# EAGLE design Oscillator_RevB (EAGLE 7.6.0)
CNAME: Oscillator (Controller+Synth); CREVISION: Rev B; DESIGNER: Tiago Angelo

## Sheet 1 of 2
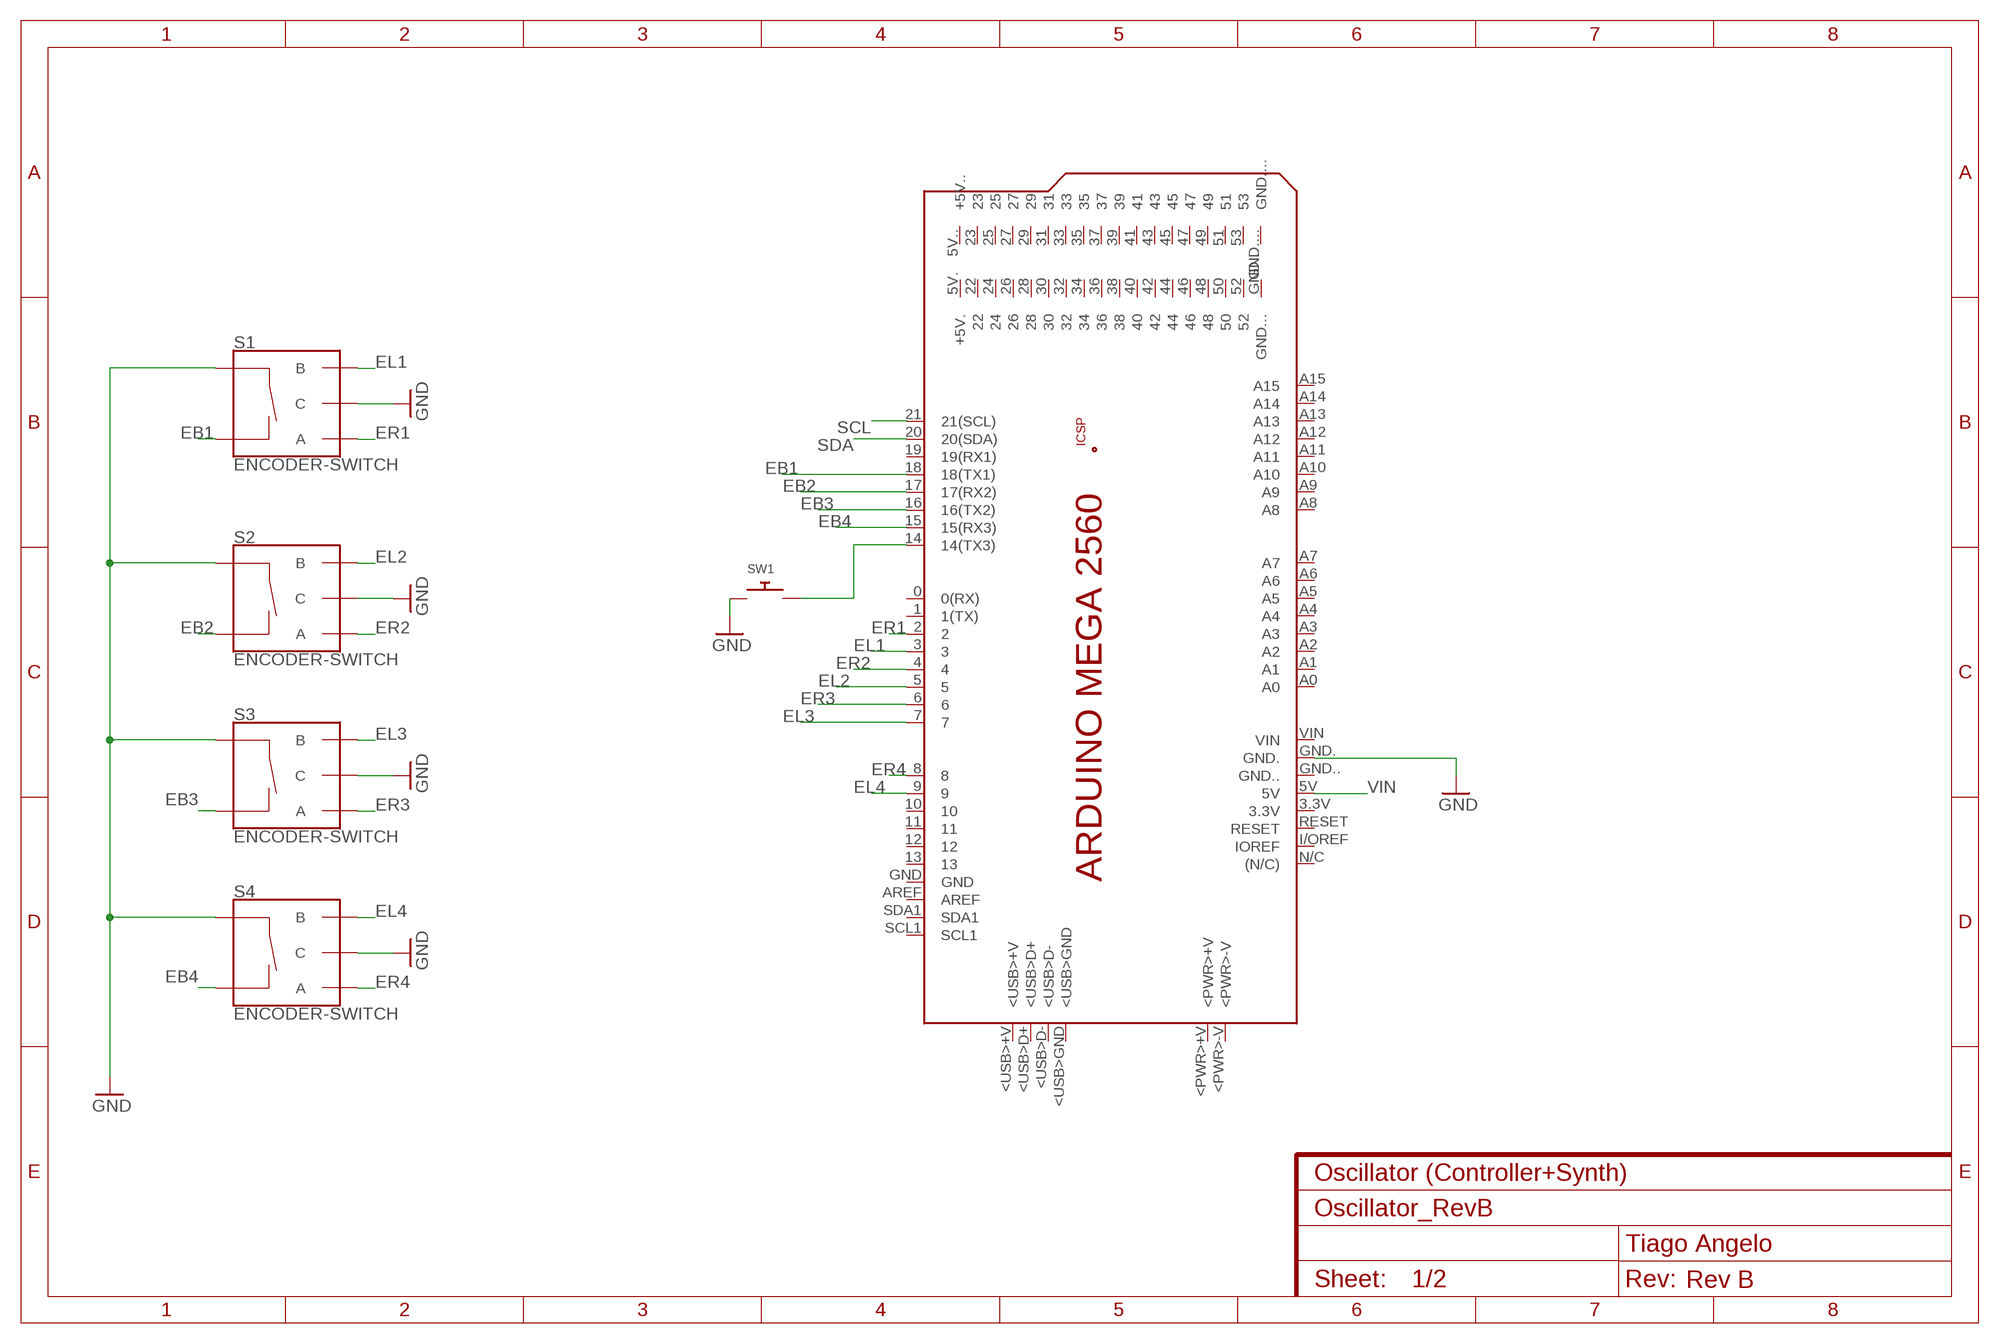
[diagram p0: schematic, sheet 1]

### Parts
PCB1  ARDUINO_MEGA2560  [ARDUINO_MEGA2560]
S1  ENCODER-SWITCH  [ROTARY_ENC_PLAIN]
S2  ENCODER-SWITCH  [ROTARY_ENC_PLAIN]
S3  ENCODER-SWITCH  [ROTARY_ENC_PLAIN]
S4  ENCODER-SWITCH  [ROTARY_ENC_PLAIN]
SW1  SWITCH_PUSHBUTTONEVQ-PE  [TACT_PANA-EVQ]

### Nets
EB1: PCB1.18(18(TX1)) S1.SW-
EB2: PCB1.17(17(RX2)) S2.SW-
EB3: PCB1.16(16(TX2)) S3.SW-
EB4: PCB1.15(15(RX3)) S4.SW-
EL1: PCB1.3 S1.B
EL2: PCB1.5 S2.B
EL3: PCB1.7 S3.B
EL4: PCB1.9 S4.B
ER1: PCB1.2 S1.A
ER2: PCB1.4 S2.A
ER3: PCB1.6 S3.A
ER4: PCB1.8 S4.A
GND: PCB1.GND. S1.C S1.SW+ S2.C S2.SW+ S3.C S3.SW+ S4.C S4.SW+ SW1.P$1 ; also sheet 2
N$7: PCB1.14(14(TX3)) SW1.P$2
SCL: PCB1.21(21(SCL)) ; also sheet 2
SDA: PCB1.20(20(SDA)) ; also sheet 2
VIN: PCB1.5V ; also sheet 2
Unconnected: PCB1.0(0(RX)) PCB1.1(1(TX)) PCB1.3.3V PCB1.5V.(+5V.) PCB1.5V..(+5V..) PCB1.10 PCB1.11 PCB1.12 PCB1.13 PCB1.19(19(RX1)) PCB1.22 PCB1.23 PCB1.24 PCB1.25 PCB1.26 PCB1.27 PCB1.28 PCB1.29 PCB1.30 PCB1.31 PCB1.32 PCB1.33 PCB1.34 PCB1.35 PCB1.36 PCB1.37 PCB1.38 PCB1.39 PCB1.40 PCB1.41 PCB1.42 PCB1.43 PCB1.44 PCB1.45 PCB1.46 PCB1.47 PCB1.48 PCB1.49 PCB1.50 PCB1.51 PCB1.52 PCB1.53 PCB1.+5V_ PCB1.<PWR>+V PCB1.<PWR>-V PCB1.<USB>+V PCB1.<USB>D+ PCB1.<USB>D- PCB1.<USB>GND PCB1.A0 PCB1.A1 PCB1.A2 PCB1.A3 PCB1.A4 PCB1.A5 PCB1.A6 PCB1.A7 PCB1.A8 PCB1.A9 PCB1.A10 PCB1.A11 PCB1.A12 PCB1.A13 PCB1.A14 PCB1.A15 PCB1.AREF PCB1.GND PCB1.GND.. PCB1.GND... PCB1.GND.... PCB1.GND__ PCB1.I/OREF(IOREF) PCB1.MISO PCB1.MOSI PCB1.N/C((N/C)) PCB1.RESET PCB1.RESET. PCB1.SCK PCB1.SCL1 PCB1.SDA1 PCB1.VIN

## Sheet 2 of 2
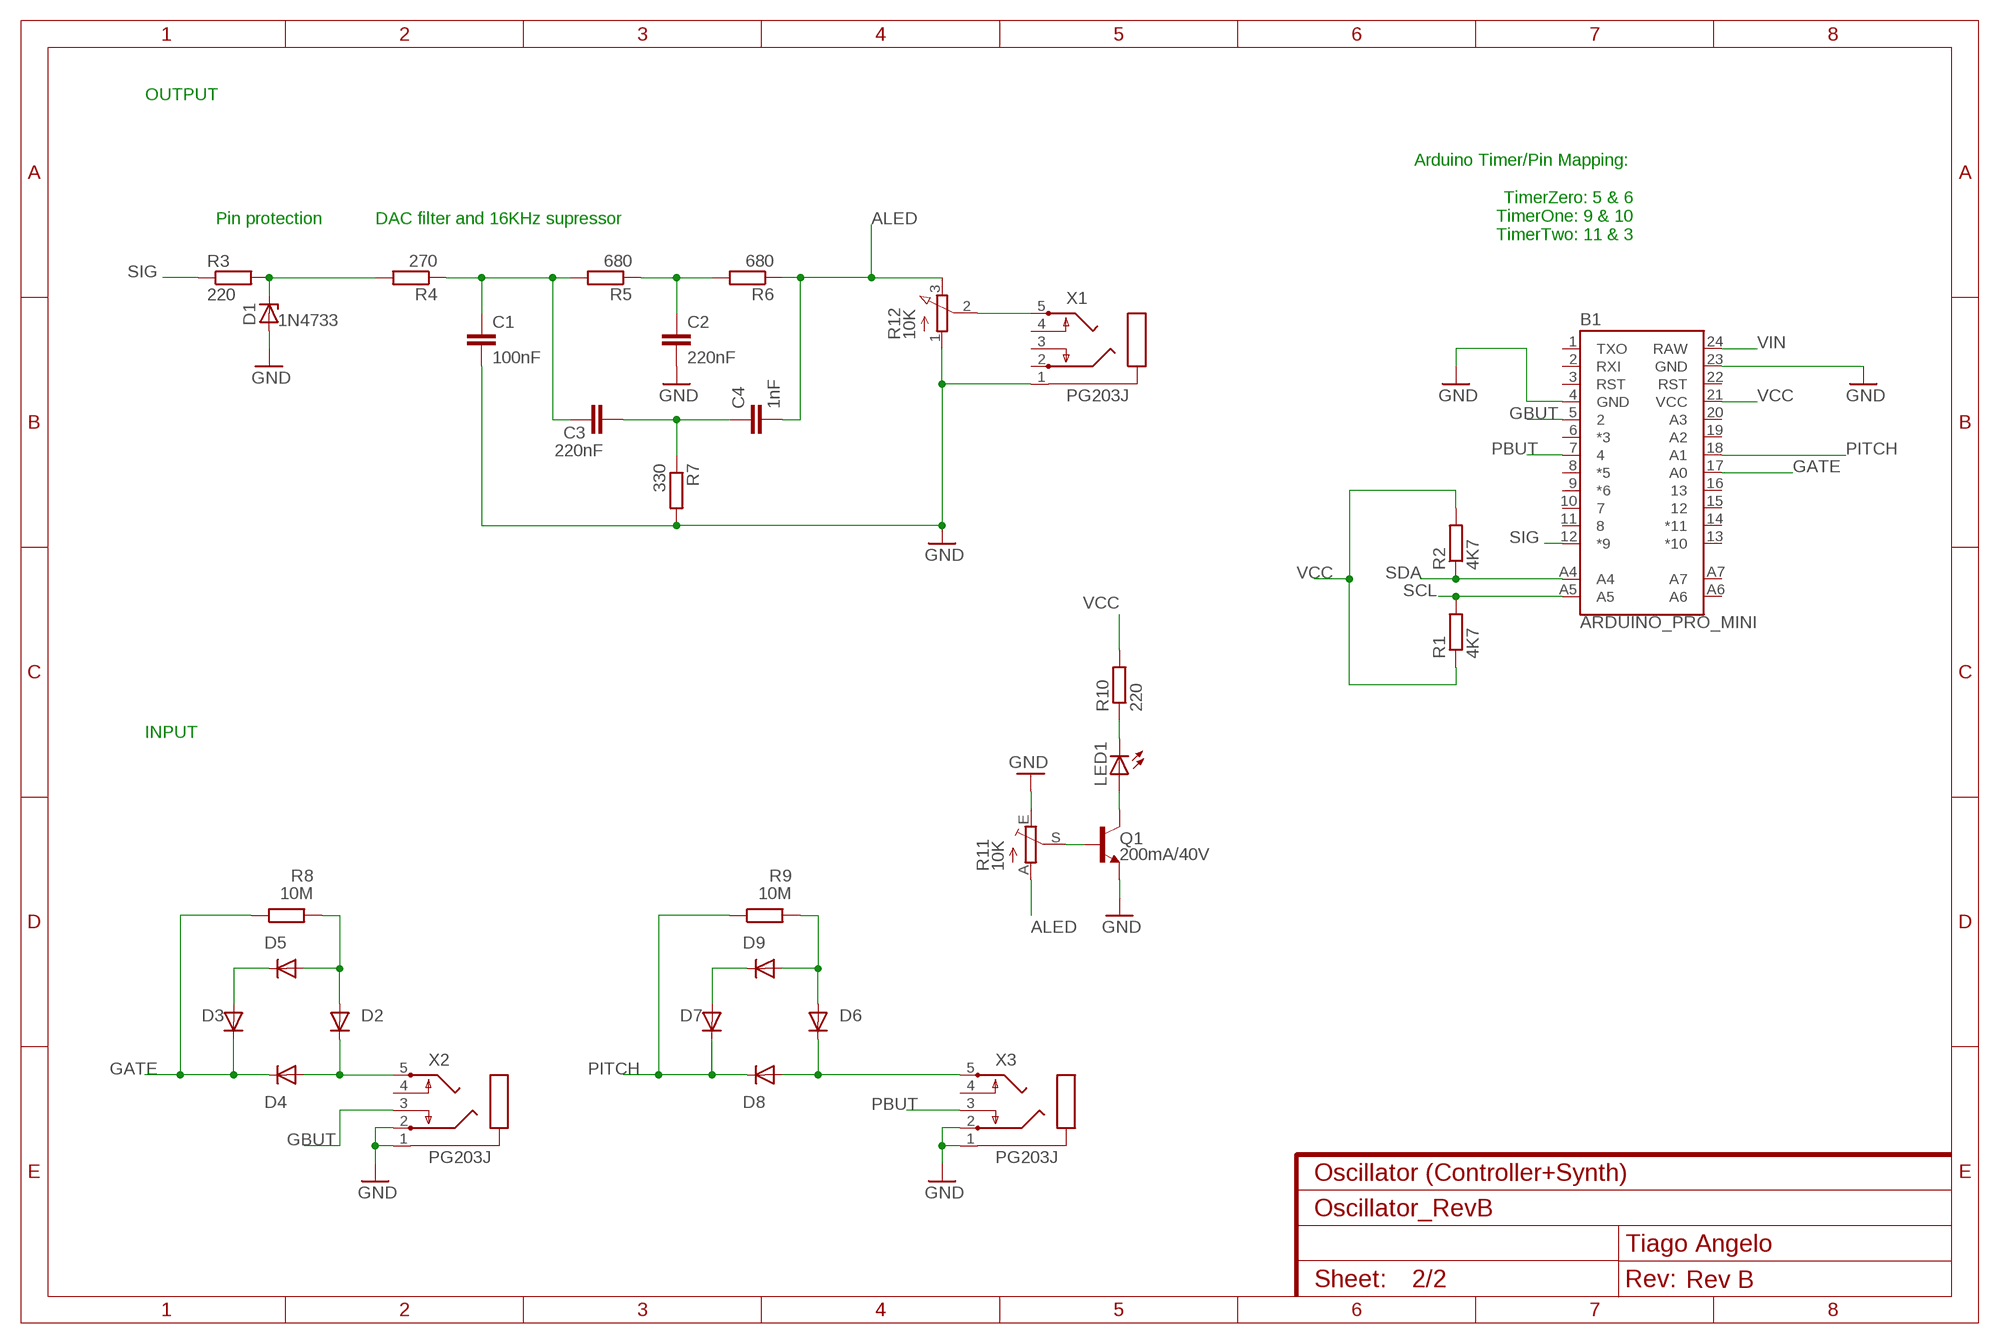
[diagram p1: schematic, sheet 2]

### Parts
B1  ARDUINO_PRO_MINI  [ARDUINO_PRO_MINI]
C1  100nF  C5/3  [C5B3]
C2  220nF  C7.5/6  [C7.5B6]
C3  220nF  C7.5/6  [C7.5B6]
C4  1nF  C5/3  [C5B3]
D1  1N4733  ZENER-DIODEDO34-7  [DO34Z7]
D2  1N4004  [DO41-10]
D3  1N4004  [DO41-10]
D4  1N4004  [DO41-10]
D5  1N4004  [DO41-10]
D6  1N4004  [DO41-10]
D7  1N4004  [DO41-10]
D8  1N4004  [DO41-10]
D9  1N4004  [DO41-10]
LED1  LED5MM  [LED5MM]
Q1  200mA/40V  TRANS_NPN-2N3904  [TO-92]
R1  4K7  R-EU_0204/7  [0204/7]
R2  4K7  R-EU_0204/7  [0204/7]
R3  220  R-EU_0204/7  [0204/7]
R4  270  R-EU_0204/7  [0204/7]
R5  680  R-EU_0204/7  [0204/7]
R6  680  R-EU_0204/7  [0204/7]
R7  330  R-EU_0204/7  [0204/7]
R8  10M  R-EU_0204/7  [0204/7]
R9  10M  R-EU_0204/7  [0204/7]
R10  220  R-EU_0204/7  [0204/7]
R11  10K  TRIM_EU-LI10  [LI10]
R12  10K  3RP/1610N  [3RP/1610N]
X1  PG203J  [PG203J]
X2  PG203J  [PG203J]
X3  PG203J  [PG203J]

### Nets
ALED: C4.2 R6.1 R11.A R12.3(E)
GATE: B1.17(A0) D3.C D4.C R8.1
GBUT: B1.5 X2.3
GND: B1.4(GND) B1.23(GND) C1.2 C2.2 D1.A Q1.1(E) R7.2 R11.E R12.1(A) X1.1 X2.1 X2.2 X3.1 X3.2 ; also sheet 1
N$1: LED1.A Q1.3(C)
N$2: LED1.K(C) R10.1
N$3: D1.C R3.2 R4.2
N$4: C1.1 C3.1 R4.1 R5.2
N$5: C2.1 R5.1 R6.2
N$6: C3.2 C4.1 R7.1
N$8: D2.C D4.A X2.5
N$9: D6.A D9.A R9.2
N$10: D2.A D5.A R8.2
N$11: D3.A D5.C
N$12: D7.A D9.C
N$14: Q1.2(B) R11.S
N$16: R12.2(S) X1.5
PBUT: B1.7 X3.3
PIT_IN: D6.C D8.A X3.5
PITCH: B1.18(A1) D7.C D8.C R9.1
SCL: B1.A5 R1.2 ; also sheet 1
SDA: B1.A4 R2.1 ; also sheet 1
SIG: B1.12(*9) R3.1
VCC: B1.21(VCC) R1.1 R2.2 R10.2
VIN: B1.24(RAW) ; also sheet 1
Unconnected: B1.1(TXO) B1.2(RXI) B1.3(RST) B1.6(*3) B1.8(*5) B1.9(*6) B1.10 B1.11 B1.13(*10) B1.14(*11) B1.15 B1.16 B1.19(A2) B1.20(A3) B1.22(RST) B1.A6 B1.A7 X1.2 X1.3 X1.4 X2.4 X3.4

### Notes on the sheet
- OUTPUT
- Arduino Timer/Pin Mapping: 
  
  TimerZero: 5 & 6
  TimerOne: 9 & 10
  TimerTwo: 11 & 3
- Pin protection | DAC filter and 16KHz supressor
- INPUT

## Library data of the parts
B1 = SparkFun-Boards:ARDUINO_PRO_MINI: SparkFun Pro Mini Pro Mini compatible footprint. Dimensions: 0.7 x 1.3" PCB Thickness: 0.8mm SparkFun Products: 3.3V/8MHz <https://www.sparkfun.com/products/11114> 5V/16MHz <https://www.sparkfun.com/products/11113>
C1-C4 = capacitor-wima:C: CAPACITOR naming: grid - package width
D1 = diode:ZENER-DIODE: Z-Diode
D2-D9 = adafruit:1N4004: DIODE General purpose 1N400x type rectifier (With bigger pads) http://www.ladyada.net/library/pcb/eaglelibrary.html
LED1 = adafruit:LED: LED OSRAM: - CHIPLED LG R971, LG N971, LY N971, LG Q971, LY Q971, LO R971, LY R971 LH N974, LH R974 LS Q976, LO Q976, LY Q976 LO Q996 - Hyper CHIPLED LW Q18S LB Q993, LB Q99A, LB R99A - SideLED LS A670, LO A670, LY A670, LG A670, LP A670 LB A673, LV A673, LT A673, LW A673 LH A674 LY A675 LS A676, LA A676, LO A676, LY A676, LW A676 LS A679, LY A679, LG A679 - Hyper Micro SIDELED® LS Y876, LA Y876, LO Y876, LY Y876 LT Y87S - SmartLED LW L88C, LW L88S LB L89C, LB L89S, LG L890 LS L89K, LO L89K, LY L89K LS L896, LA L896, LO L896, LY L896 - TOPLED LS T670, LO T670, LY T670, LG T670, LP T670 LSG T670, LSP T670, LSY T670, LOP T670, LYG T670 LG T671, LOG T671, LSG T671 LB T673, LV T673, LT T673, LW T673 LH T674 LS T676, LA T676, LO T676, LY T676, LB T676, LH T676, LSB T676, LW T676 LB T67C, LV T67C, LT T67C, LS T67K, LO T67K, LY T67K, LW E67C LS E67B, LA E67B, LO E67B, LY E67B, LB E67C, LV E67C, LT E67C LW T67C LS T679, LY T679, LG T679 LS T770, LO T770, LY T770, LG T770, LP T770 LB T773, LV T773, LT T773, LW T773 LH T774 LS E675, LA E675, LY E675, LS T675 LS T776, LA T776, LO T776, LY T776, LB T776 LHGB T686 LT T68C, LB T68C - Hyper Mini TOPLED® LB M676 - Mini TOPLED Santana® LG M470 LS M47K, LO M47K, LY M47K Source: http://www.osram.convergy.de/
PCB1 = E14_Arduino_revC:ARDUINO_MEGA2560: Device for representing an Arduino Mega 2560 board with a footprint in an EAGLE design. Created by Dave Young for Element14. More EAGLE documentation at: http://www.element14.com/community/community/knode/cadsoft_eagle
Q1 = SparkFun-DiscreteSemi:TRANS_NPN: NPN transistor Current controlled devices typically used to amplify current or used as a switch. BC547 - COM-08928 <http://www.sparkfun.com/products/8928> (TO-92 45V 100mA) (1.Collector 2.Base 3.Emitter) 2N3904 - COM-00521 <http://www.sparkfun.com/products/521> (TO-92 40V 200mA) (1.Emitter 2.Base 3.Collector) P2N2222A - COM-12852 <http://www.sparkfun.com/products/12852> (TO-92 40V 600mA) (1.Collector 2.Base 3.Emitter); PROD_ID: TRANS-08447
R1-R10 = resistor:R-EU_: RESISTOR, European symbol
R11 = pot:TRIM_EU-: POTENTIOMETER
R12 = pot:3RP/1610N: 16mm Potentiometer one level Source: http://www.alphapotentiometers.net/html/16mm_pot_2.html
S1-S4 = SparkFun-Switches:ENCODER-SWITCH: Rotary Encoder w/ Select Switch Encoders rotate similarly to potentiometers, but they’re different from potentiometers in that an encoder has full rotation without limits. They output gray code so that you can tell how much and in which direction the encoder has been turned. This encoder includes a push-down select switch built into the shaft. SparkFun Products Rotary Encoder <https://www.sparkfun.com/products/9117> (COM-09117); SF_SKU: COM-09117
SW1 = adafruit:SWITCH_PUSHBUTTON: Buttons SOFTTOUCHSMD_SJ - Soft touch temporary push button (Super Junk Akihabara) Compatible with SKPMANE010 [Mouser: 688-SKPMAN] C&K_KSS = Digikey: KSS221GLFS
X1-X3 = con-hirschmann:PG203J: MIC/HEADPHONE JACK KS-S stereo microphone/headphone jack PG203JN (Schukat); OC_FARNELL: unknown; OC_NEWARK: unknown

## Board
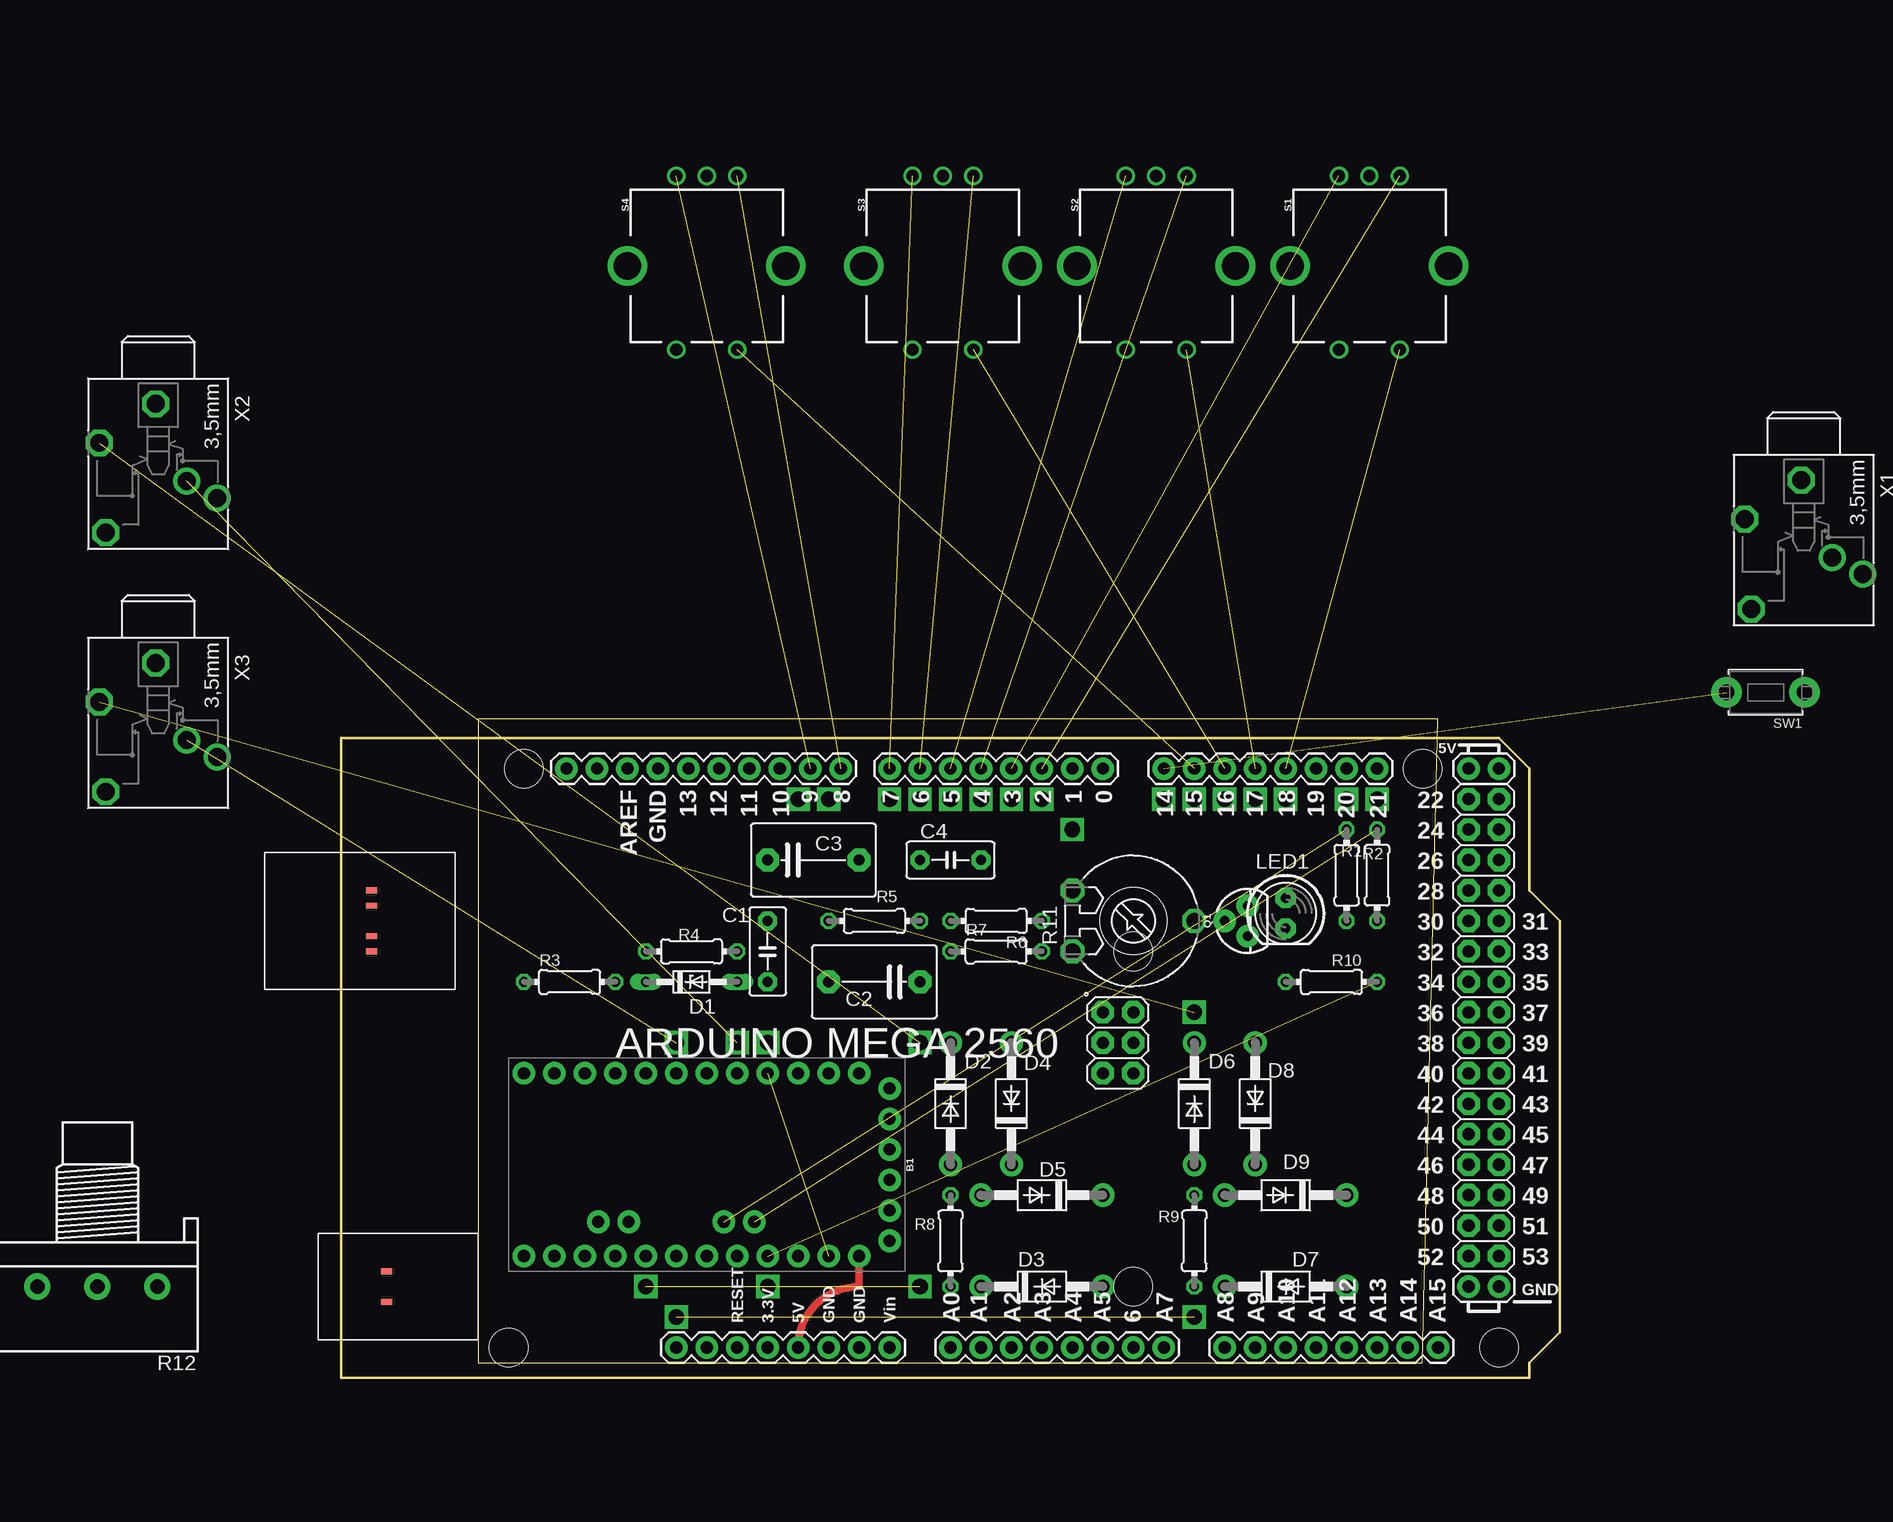
[diagram p2: board, top side]
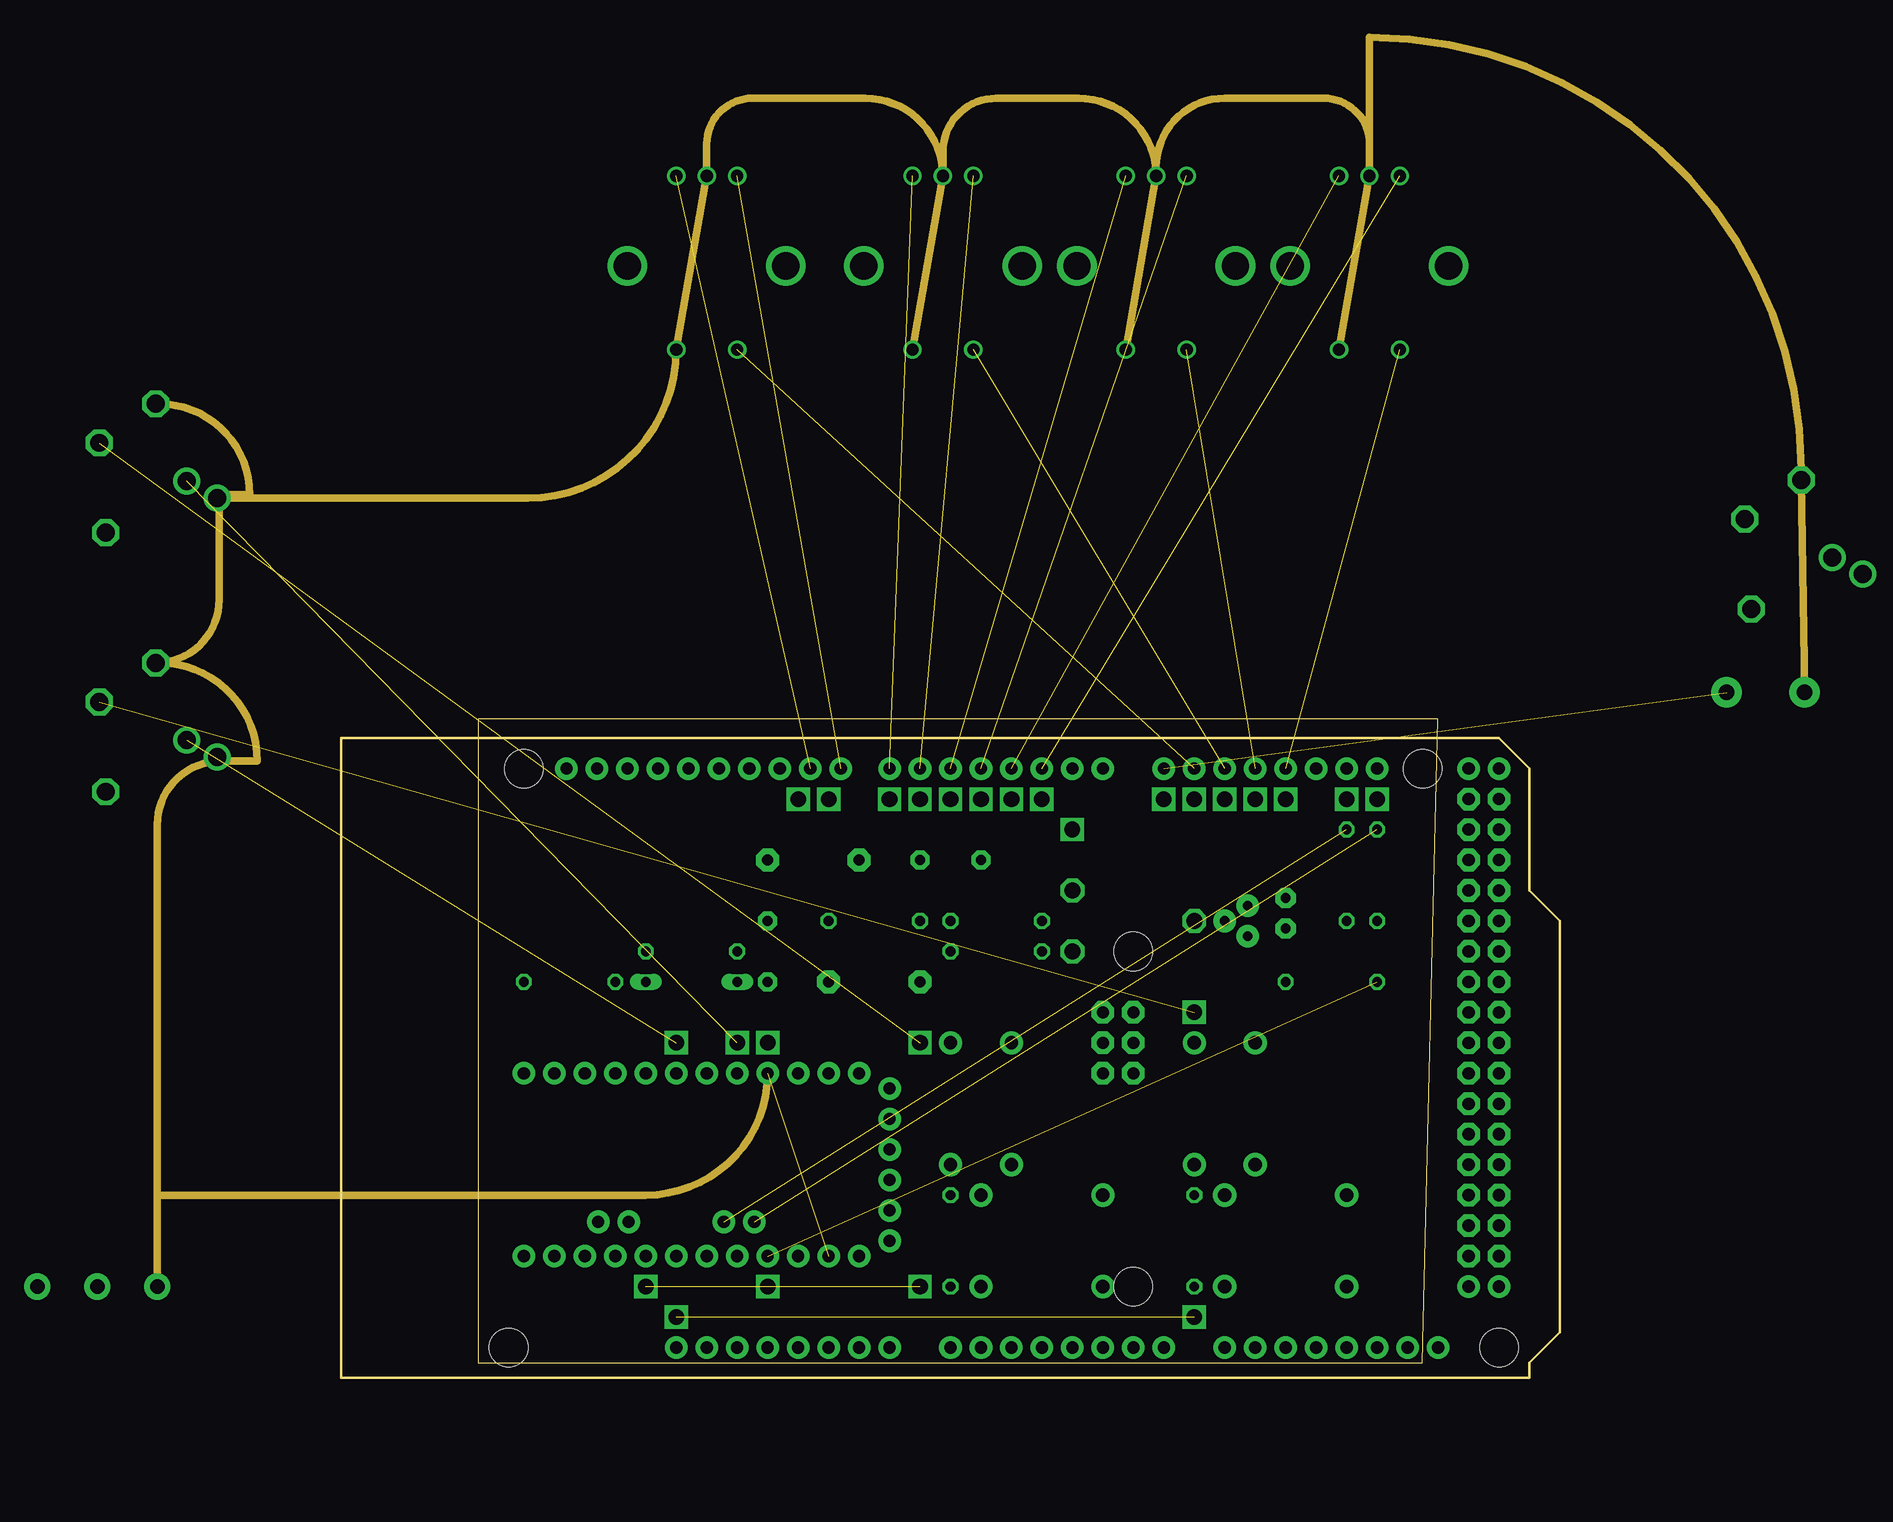
[diagram p3: board, inner layer Route2]
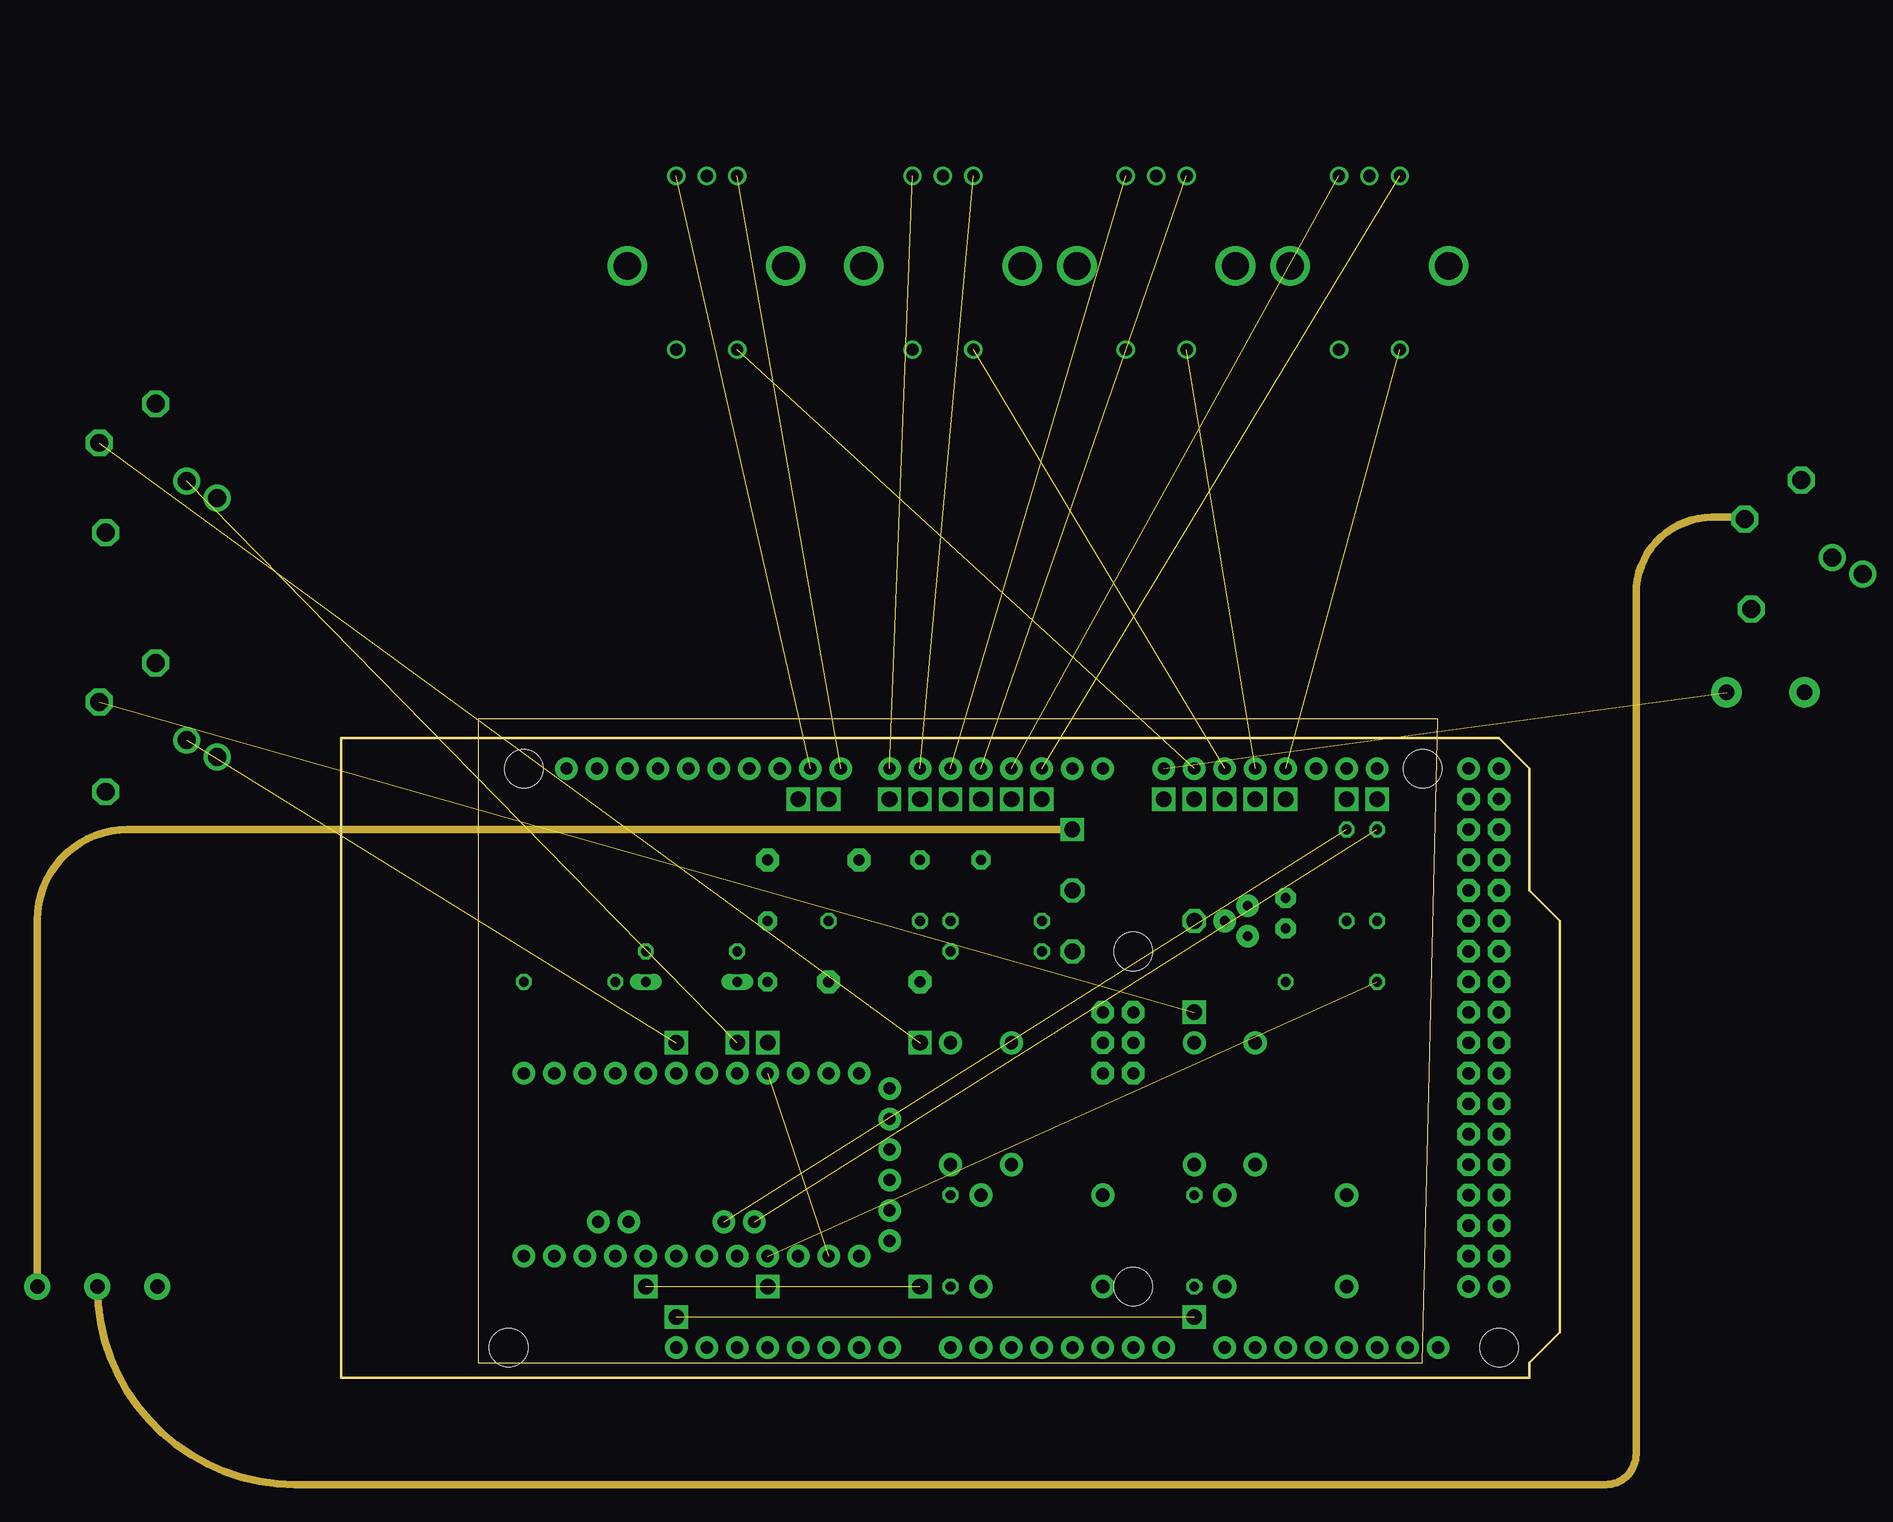
[diagram p4: board, inner layer Route15]
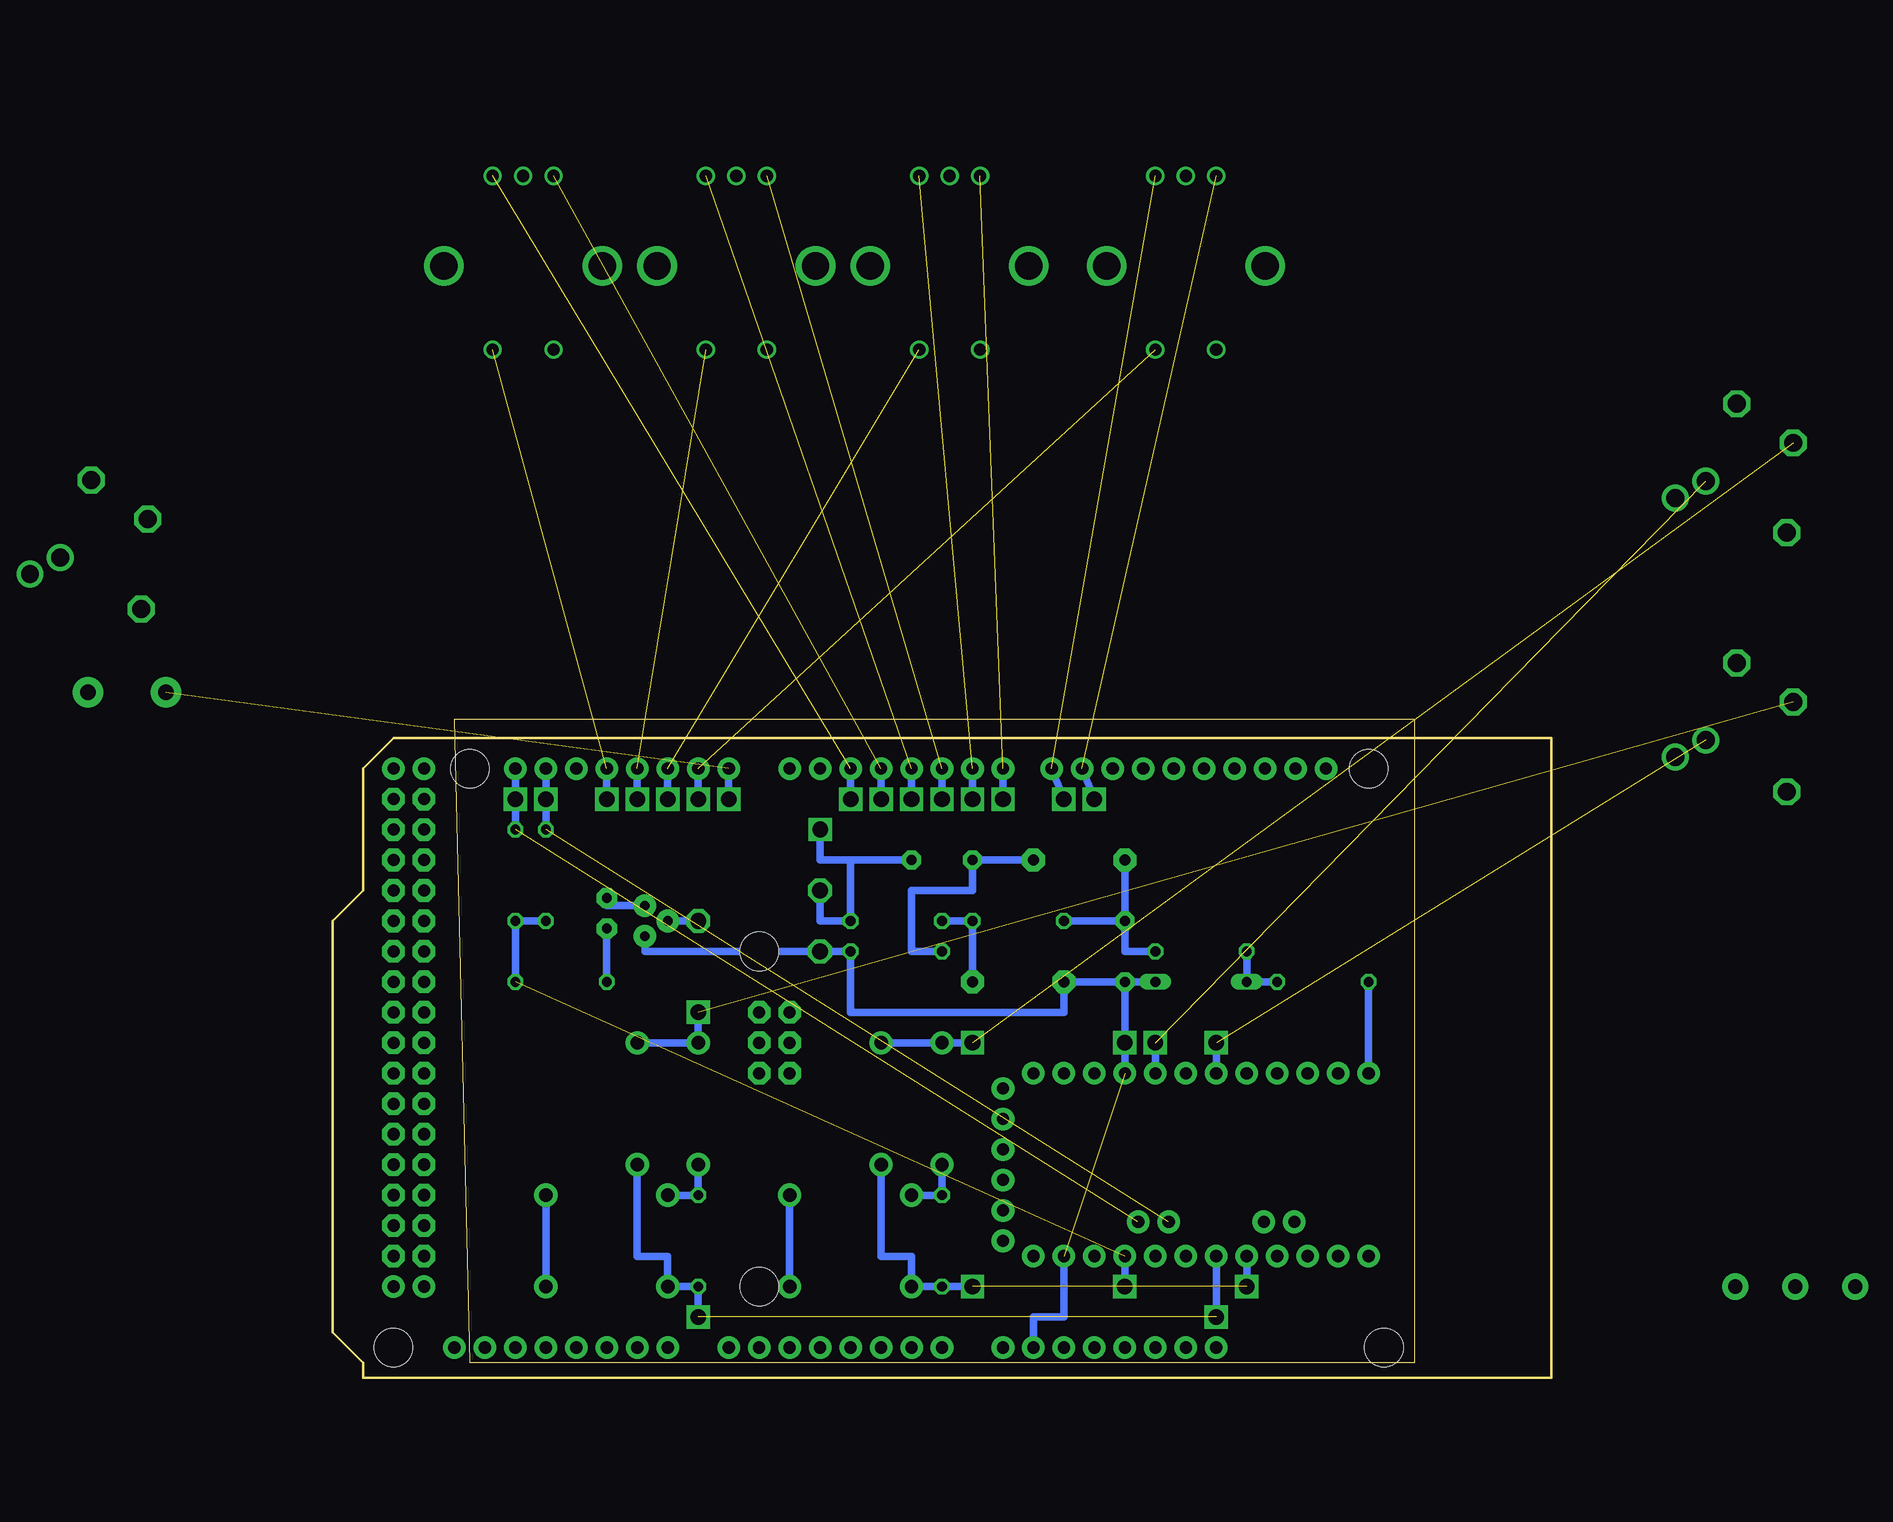
[diagram p5: board, bottom side, seen from below]

Size 101.6 x 54.92 mm. Coordinates in mm from the lower left corner, seen from the top.
Outline: 11.43,1.27 90.15,1.27 91.42,54.92 11.43,54.92 11.43,1.27
Copper layers ((1*2)+(15*16)): Top 0.035mm / dielectric 1.5mm / Route2 0.035mm / dielectric 0.15mm / Route15 0.035mm / dielectric 0.2mm / Bottom 0.035mm
Design rules "default *": minimum track width 10mil, minimum drill 24mil, track to track 8mil, track to pad 8mil, pad to pad 8mil, via to via 8mil, smd to smd 8mil, copper to edge 40mil, drill to drill 8mil, minimum pad ring 10mil, minimum via ring 8mil, stop-mask expansion 4mil, vias tented up to drill 0mil, thermal gap 10mil
vRestrict: area 62.2,24.1 to 67.3,31.8; area 92.7,6.3 to 97.8,52.1

### Footprints (pad centres in the part's own frame; a part is rotated, then mirrored left to right if it is on the bottom)
ARDUINO_PRO_MINI = drill 1.016 pad 1.88: 1 -7.62,12.7; 2 -7.62,10.16; 3 -7.62,7.62; 4 -7.62,5.08; 5 -7.62,2.54; 6 -7.62,0; 7 -7.62,-2.54; 8 -7.62,-5.08; 9 -7.62,-7.62; 10 -7.62,-10.16; 11 -7.62,-12.7; 12 -7.62,-15.24; 13 7.62,-15.24; 14 7.62,-12.7; 15 7.62,-10.16; 16 7.62,-7.62; 17 7.62,-5.08; 18 7.62,-2.54; 19 7.62,0; 20 7.62,2.54; 21 7.62,5.08; 22 7.62,7.62; 23 7.62,10.16; 24 7.62,12.7; A4 4.763,1.429; A5 4.763,3.969; A6 4.763,-9.049; A7 4.763,-6.509; BLK -6.35,15.24; GND -3.81,15.24; GRN 6.35,15.24; RXI 1.27,15.24; TXO 3.81,15.24; VCC -1.27,15.24
C5B3 = drill 0.813 pad 1.6 octagon: 1 -2.54,0; 2 2.54,0
C7.5B6 = drill 0.914 pad 1.905 octagon: 1 -3.81,0; 2 3.81,0
DO34Z7 = drill 0.813 long: A 3.81,0; C -3.81,0
DO41-10 = drill 1.118 pad 1.93: A 5.08,0; C -5.08,0
LED5MM = drill 0.813 pad 1.676 octagon: A -1.27,0; K 1.27,0
ARDUINO_MEGA2560 = drill 1.016 pad 1.88: 0 63.5,50.8; 1 60.96,50.8; 2 58.42,50.8; 3 55.88,50.8; 3.3V 35.56,2.54; 4 53.34,50.8; 5 50.8,50.8; 5V 38.1,2.54; 5V. 93.98,50.8; 5V.. 96.52,50.8; 6 48.26,50.8; 7 45.72,50.8; 8 41.656,50.8; 9 39.116,50.8; 10 36.576,50.8; 11 34.036,50.8; 12 31.496,50.8; 13 28.956,50.8; 14 68.58,50.8; 15 71.12,50.8; 16 73.66,50.8; 17 76.2,50.8; 18 78.74,50.8; 19 81.28,50.8; 20 83.82,50.8; 21 86.36,50.8; A0 50.8,2.54; A1 53.34,2.54; A2 55.88,2.54; A3 58.42,2.54; A4 60.96,2.54; A5 63.5,2.54; A6 66.04,2.54; A7 68.58,2.54; A8 73.66,2.54; A9 76.2,2.54; A10 78.74,2.54; A11 81.28,2.54; A12 83.82,2.54; A13 86.36,2.54; A14 88.9,2.54; A15 91.44,2.54; AREF 23.876,50.8; GND 26.416,50.8; GND. 43.18,2.54; GND.. 40.64,2.54; GND... 93.98,7.62; GND.... 96.52,7.62; I/OREF 30.48,2.54; N/C 27.94,2.54; RESET 33.02,2.54; SCL1 18.796,50.8; SDA1 21.336,50.8; VIN 45.72,2.54 | drill 1.016 pad 1.88 octagon: 22 93.98,48.26; 23 96.52,48.26; 24 93.98,45.72; 25 96.52,45.72; 26 93.98,43.18; 27 96.52,43.18; 28 93.98,40.64; 29 96.52,40.64; 30 93.98,38.1; 31 96.52,38.1; 32 93.98,35.56; 33 96.52,35.56; 34 93.98,33.02; 35 96.52,33.02; 36 93.98,30.48; 37 96.52,30.48; 38 93.98,27.94; 39 96.52,27.94; 40 93.98,25.4; 41 96.52,25.4; 42 93.98,22.86; 43 96.52,22.86; 44 93.98,20.32; 45 96.52,20.32; 46 93.98,17.78; 47 96.52,17.78; 48 93.98,15.24; 49 96.52,15.24; 50 93.98,12.7; 51 96.52,12.7; 52 93.98,10.16; 53 96.52,10.16; +5V_ 66.04,30.48; GND__ 66.04,25.4; MISO 63.5,30.48; MOSI 66.04,27.94; RESET. 63.5,25.4; SCK 63.5,27.94 | smd 1.016 x 0.508: <PWR>+V 3.81,8.89; <PWR>-V 3.81,6.35; <USB>+V 2.54,40.64; <USB>D+ 2.54,39.37; <USB>D- 2.54,36.83; <USB>GND 2.54,35.56 | hole 3.2: 15.24,50.8; 13.97,2.54; 66.04,35.56; 66.04,7.62; 90.17,50.8; 96.52,2.54
TO-92 = drill 0.813 pad 1.88: 1 -1.27,0; 2 0,1.905; 3 1.27,0
0204/7 = drill 0.813 octagon: 1 -3.81,0; 2 3.81,0
LI10 = drill 1.321 octagon: A -2.54,-5.08; E 2.54,-5.08; S 0,5.08
3RP/1610N = drill 1.2 pad 2.184: 1 -5,0; 2 0,0; 3 5,0
ROTARY_ENC_PLAIN = drill 1.016: A 7.493,-2.54; B 7.493,2.54; C 7.493,0; SW+ -6.985,2.54; SW- -6.985,-2.54 | drill 2.286: P$3 0,6.604; P$4 0,-6.604
TACT_PANA-EVQ = drill 1.3 pad 2.54: P$1 -3.25,0; P$2 3.25,0
PG203J = drill 1.499 octagon: 1 -5.004,-0.203; 4 5.74,-4.369; 5 -1.753,-4.902 | drill 1.499: 2 2.845,4.902; 3 1.448,2.388

### Placement (x,y rotation side)
B1  30.48,17.78 270 top
C1  35.56,35.56 270 top
C2  44.45,33.02 180 top
C3  39.37,43.18 0 top
C4  50.8,43.18 0 top
D1  29.21,33.02 0 top
D2  50.8,22.86 270 top
D3  58.42,7.62 0 top
D4  55.88,22.86 90 top
D5  58.42,15.24 180 top
D6  71.12,22.86 270 top
D7  78.74,7.62 0 top
D8  76.2,22.86 90 top
D9  78.74,15.24 180 top
LED1  78.74,38.74 270 top
PCB1  0,0 0 top
Q1  75.56,38.1 90 top
R1  86.36,41.91 90 top
R2  83.82,41.91 270 top
R3  19.05,33.02 0 top
R4  29.21,35.56 180 top
R5  44.45,38.1 180 top
R6  54.61,38.1 180 top
R7  54.61,35.56 0 top
R8  50.8,11.43 90 top
R9  71.12,11.43 90 top
R10  82.55,33.02 0 top
R11  66.04,38.1 270 top
R12  -20.32,7.62 180 top  (outside the outline)
S1  85.72,92.71 90 top  (outside the outline)
S2  67.94,92.71 90 top  (outside the outline)
S3  50.16,92.71 90 top  (outside the outline)
S4  30.48,92.71 90 top  (outside the outline)
SW1  118.75,57.15 180 top  (outside the outline)
X1  121.92,69.85 270 top  (outside the outline)
X2  -15.24,76.2 270 top  (outside the outline)
X3  -15.24,54.61 270 top  (outside the outline)

### Tracks (layer width: path | path; a pad name or v marks a point on that pad's centre or on a via)
ALED  (via drill 1.3)
  Route15 0.61: R12.3 -25.32,38.18 arc-90 -17.78,45.72 v60.96,45.72
  Bottom 0.61: C4.2 58.42,43.18 | R11.A 60.96,38.1 R6.1 58.42,41.91 58.42,43.18 | v60.96,45.72 60.96,43.18 58.42,43.18
EB1  (via drill 1.3)  (1 unrouted)
  Bottom 0.61: PCB1.18 v78.74,48.26
EB2  (via drill 1.3)  (1 unrouted)
  Bottom 0.61: PCB1.17 v76.2,48.26
EB3  (via drill 1.3)  (1 unrouted)
  Bottom 0.61: PCB1.16 v73.66,48.26
EB4  (via drill 1.3)  (1 unrouted)
  Bottom 0.61: PCB1.15 v71.12,48.26
EL1  (via drill 1.3)  (1 unrouted)
  Bottom 0.61: v55.88,48.26 PCB1.3
EL2  (via drill 1.3)  (1 unrouted)
  Bottom 0.61: v50.8,48.26 PCB1.5
EL3  (via drill 1.3)  (1 unrouted)
  Bottom 0.61: v45.72,48.26 PCB1.7
EL4  (via drill 1.3)  (1 unrouted)
  Bottom 0.61: v38.1,48.26 PCB1.9
ER1  (via drill 1.3)  (1 unrouted)
  Bottom 0.61: v58.42,48.26 PCB1.2
ER2  (via drill 1.3)  (1 unrouted)
  Bottom 0.61: v53.34,48.26 PCB1.4
ER3  (via drill 1.3)  (1 unrouted)
  Bottom 0.61: v48.26,48.26 PCB1.6
ER4  (via drill 1.3)  (1 unrouted)
  Bottom 0.61: v40.64,48.26 PCB1.8
GATE  (via drill 1.3)  (1 unrouted)
  Bottom 0.61: D4.C 55.88,10.16 53.34,10.16 D3.C R8.1 v48.26,7.62 | B1.17 v25.4,7.62
GBUT  (via drill 1.3)  (1 unrouted)
  Bottom 0.61: B1.5 v33.02,27.94
GND  (via drill 1.3)  (1 unrouted)
  Route2 0.61: S3.SW+ S3.C | S2.SW+ S2.C | S1.SW+ S1.C 85.72,102.87 | SW1.P$1 X1.1 121.72,75.77 arc90 85.72,111.76 85.72,102.87 | X2.1 -15.16,81.2 arc-90 -7.62,73.66 -10.03,73.66 arc90 X2.2 | X2.2 -10.34,73.48 arc-90 -10.16,73.66 -10.16,64.9 arc-90 X3.1 -15.16,59.61 arc-90 -6.98,51.44 -10.01,51.44 | -10.01,51.44 arc-90 X3.2 | X2.2 15.57,73.35 arc90 S4.SW+ S4.C 30.48,102.87 arc-90 34.29,106.68 43.69,106.68 arc-90 S3.C | -10.01,51.44 arc90 -15.32,46.12 -15.32,15.24 | -15.32,15.24 R12.1 | S3.C 50.16,102.23 arc-90 54.61,106.68 61.47,106.68 arc-90 S2.C | S2.C 67.94,100.96 arc-90 73.66,106.68 81.91,106.68 arc-90 85.72,102.87 | B1.4 arc-90 25.4,15.24 -15.32,15.24
  Bottom 0.61: C1.2 D1.A | C1.2 C2.2 40.64,30.48 58.42,30.48 R7.2 R11.E 75.56,35.56 Q1.1 | PCB1.GND. 43.18,5.08 40.64,5.08 B1.23 | B1.4 v35.56,27.94 C1.2
N$1
  Bottom 0.61: Q1.3 78.74,39.37 LED1.A
N$2
  Bottom 0.61: LED1.K R10.1
N$3
  Bottom 0.61: R3.2 D1.C R4.2
N$4
  Bottom 0.61: R4.1 35.56,35.56 C1.1 | C1.1 R5.2 | C1.1 C3.1
N$5
  Bottom 0.61: R6.2 R5.1 C2.1
N$6
  Bottom 0.61: C3.2 C4.1 48.26,40.64 53.34,40.64 53.34,35.56 R7.1
N$7  (via drill 1.3)  (1 unrouted)
  Bottom 0.61: v68.58,48.26 PCB1.14
N$8  (via drill 1.3)  (1 unrouted)
  Bottom 0.61: D4.A D2.C v48.26,27.94
N$9
  Bottom 0.61: D9.A R9.2 D6.A
N$10
  Bottom 0.61: D2.A R8.2 D5.A
N$11
  Bottom 0.61: D5.C D3.A
N$12
  Bottom 0.61: D7.A D9.C
N$14
  Bottom 0.61: R11.S Q1.2
N$16
  Route15 0.61: R12.2 arc90 -3.81,-8.89 105.41,-8.89 arc90 107.95,-6.35 107.95,65.41 arc-90 114.3,71.75 116.87,71.75 arc-90 X1.5
PBUT  (via drill 1.3)  (1 unrouted)
  Bottom 0.61: B1.7 v27.94,27.94
PIT_IN  (via drill 1.3)  (1 unrouted)
  Bottom 0.61: D8.A D6.C v71.12,30.48
PITCH  (via drill 1.3)  (1 unrouted)
  Bottom 0.61: D8.C 76.2,10.16 73.66,10.16 D7.C R9.1 v71.12,5.08 | B1.18 v27.94,5.08
SCL  (via drill 1.3)  (1 unrouted)
  Bottom 0.61: PCB1.21 v86.36,48.26 R1.2
SDA  (via drill 1.3)  (1 unrouted)
  Bottom 0.61: PCB1.20 v83.82,48.26 R2.1
SIG
  Bottom 0.61: B1.12 R3.1
VCC  (via drill 1.3)  (1 unrouted)
  Bottom 0.61: R10.2 R1.1 R2.2 | B1.21 v35.56,7.62
VIN
  Top 0.61: PCB1.5V arc-90 43.18,7.62 B1.24